# Altium project IOTk2.PrjPcb
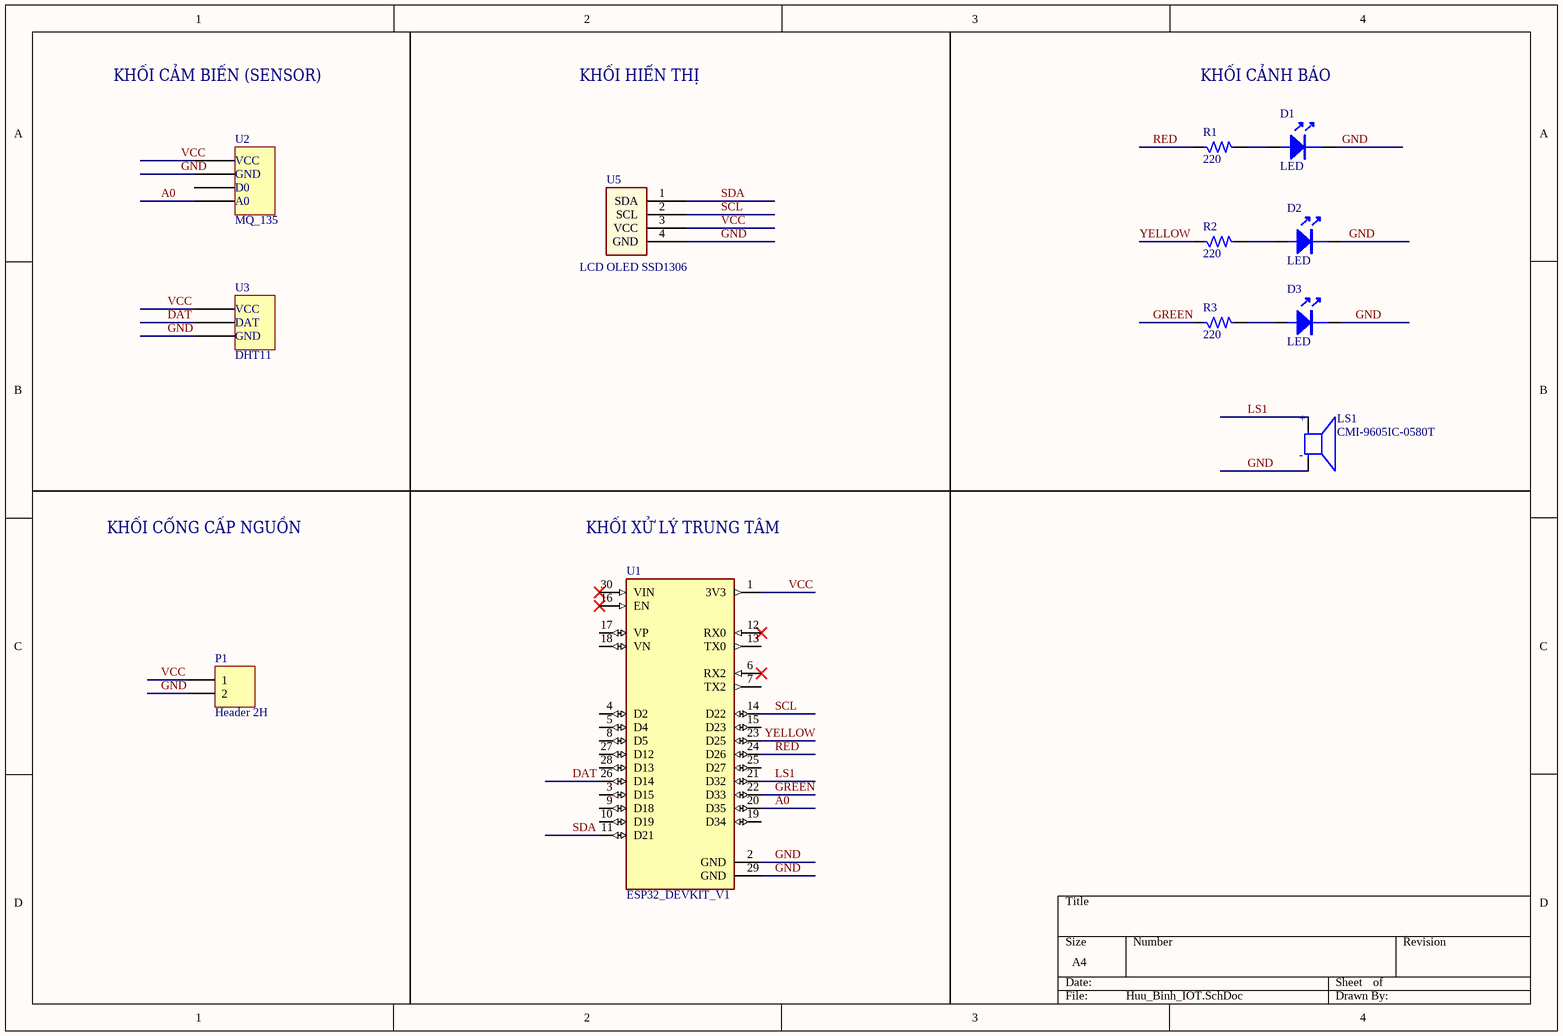
[diagram p0: Huu_Binh_IOT.SchDoc]
1 sheet, 12 parts. Net scope: global (net labels, ports and power ports of the same name join across sheets).
Board file: IoTs_PCB.PcbDoc

## Sheet Huu_Binh_IOT.SchDoc
size A4; DrawnBy: NGUYỄN HỮU BÌNH; SheetNumber: 1; SheetTotal: 1

### Parts
D1  LED  [CAP10UF]
D2  LED  [CAP10UF]
D3  LED  [CAP10UF]
LS1  CMI-9605IC-0580T  [CUI_CMI-9605IC-0580T]
P1  Header 2H  [HDR1X2H]
R1  220  [R1/6W]
R2  220  [R1/6W]
R3  220  [R1/6W]
U1  ESP32_DEVKIT_V1  [ESP32_DEVKIT_V1]
U2  MQ_135  [MQ_135]
U3  DHT11  [DHT11]
U5  LCD OLED SSD1306  [LCD SH1106]

### Nets
A0: U1.20(D35) U2.4
DAT: U1.26(D14) U3.2
GND: D1.2 D2.2 D3.2 LS1.N P1.2 U1.2(GND) U1.29(GND) U2.2 U3.3 U5.4(GND)
GREEN: R3.1 U1.22(D33)
LS1: LS1.P U1.21(D32)
RED: R1.1 U1.24(D26)
SCL: U1.14(D22) U5.2(SCL)
SDA: U1.11(D21) U5.1(SDA)
VCC: P1.1 U1.1(3V3) U2.1 U3.1 U5.3(VCC)
YELLOW: R2.1 U1.23(D25)
NetD1_1: D1.1 R1.2
NetD2_1: D2.1 R2.2
NetD3_1: D3.1 R3.2

Not connected (* = marked no-connect by the designer): U1 3(D15) 4(D2) 5(D4) 6(RX2)* 7(TX2) 8(D5) 9(D18) 10(D19) 12(RX0)* 13(TX0) 15(D23) 16(EN)* 17(VP) 18(VN) 19(D34) 25(D27) 27(D12) 28(D13) 30(VIN)*; U2 3

### Notes on the sheet
- KHỐI CẢM BIẾN (SENSOR)
- KHỐI HIỂN THỊ
- KHỐI CẢNH BÁO
- KHỐI CỔNG CẤP NGUỒN
- KHỐI XỬ LÝ TRUNG TÂM
- (in symbol CMI-9605IC-0580T) +; -
- (in symbol DHT11) VCC; DAT; GND
- (in symbol MQ_135) VCC; GND; D0; A0

### Library data of the parts
LS1 = CMI-9605IC-0580T: 9.6 mm, 5 Vdc, 80 dB, Through Hole, Driving Circuit, Magnetic Audio Indicator Buzzer; MF: Same Sky; SnapEDA_Link: https://www.snapeda.com/parts/CMI-9605IC-0580T/Same+Sky/view-part/?ref=snap; Package: Package; Value: *; MP: CMI-9605IC-0580T; Check_prices: https://www.snapeda.com/parts/CMI-9605IC-0580T/Same+Sky/view-part/?ref=eda
P1 = Header 2H: Header, 2-Pin, Right Angle; LatestRevisionDate: 17-Jul-2002; LatestRevisionNote: Re-released for DXP Platform.; Publisher: Altium Limited
R1-R3 = Res: Resistor 1/4W; Value: R1/4W - 1K
U5 = LCD SH1106